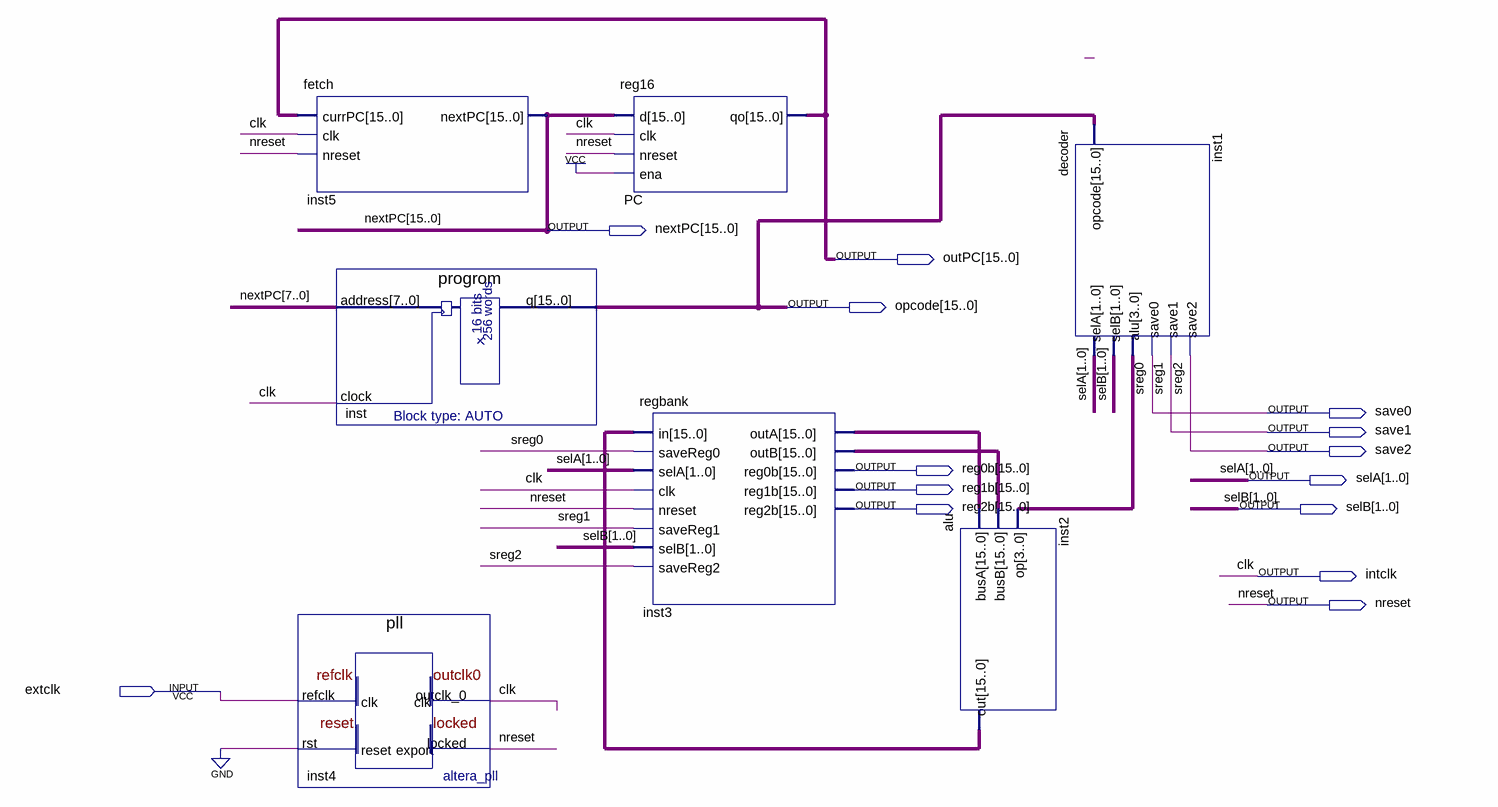
[diagram p0: schematic sheet]
// Quartus schematic top.bdf as structural Verilog: 7 symbols, 14 pins
module top (
  input  extclk,
  output [15:0] nextPC,
  output [15:0] outPC,
  output [15:0] opcode,
  output save0,
  output save1,
  output save2,
  output [15:0] reg0b,
  output [1:0] selA,
  output [15:0] reg1b,
  output [15:0] reg2b,
  output [1:0] selB,
  output intclk,
  output nreset
);

  wire [3:0] inst1_alu;
  wire [15:0] inst2_out, inst3_outa, inst3_outb;

  fetch inst5 (.currPC(outPC), .clk(intclk), .nreset(nreset), .nextPC(nextPC));
  progrom inst (.address(nextPC[7:0]), .clock(intclk), .q(opcode));
  pll inst4 (.refclk(extclk), .rst(1'b0), .outclk_0(intclk), .locked(nreset));
  reg16 PC (.d(nextPC), .clk(intclk), .nreset(nreset), .ena(1'b1), .qo(outPC));
  regbank inst3 (
    .in(inst2_out), .saveReg0(save0), .selA(selA), .clk(intclk), .nreset(nreset), .saveReg1(save1),
    .selB(selB), .saveReg2(save2), .outA(inst3_outa), .outB(inst3_outb), .reg0b(reg0b), .reg1b(reg1b),
    .reg2b(reg2b));
  alu inst2 (.busA(inst3_outa), .busB(inst3_outb), .op(inst1_alu), .out(inst2_out));
  decoder inst1 (
    .opcode(opcode), .selA(selA), .selB(selB), .alu(inst1_alu), .save0(save0), .save1(save1), .save2(save2));

  // Other names for the same wires on the sheet: clk = intclk; sreg0 = save0; sreg1 = save1; sreg2 = save2
endmodule
